# EAGLE schematic CALalarm-r0 (EAGLE 7.7.0)
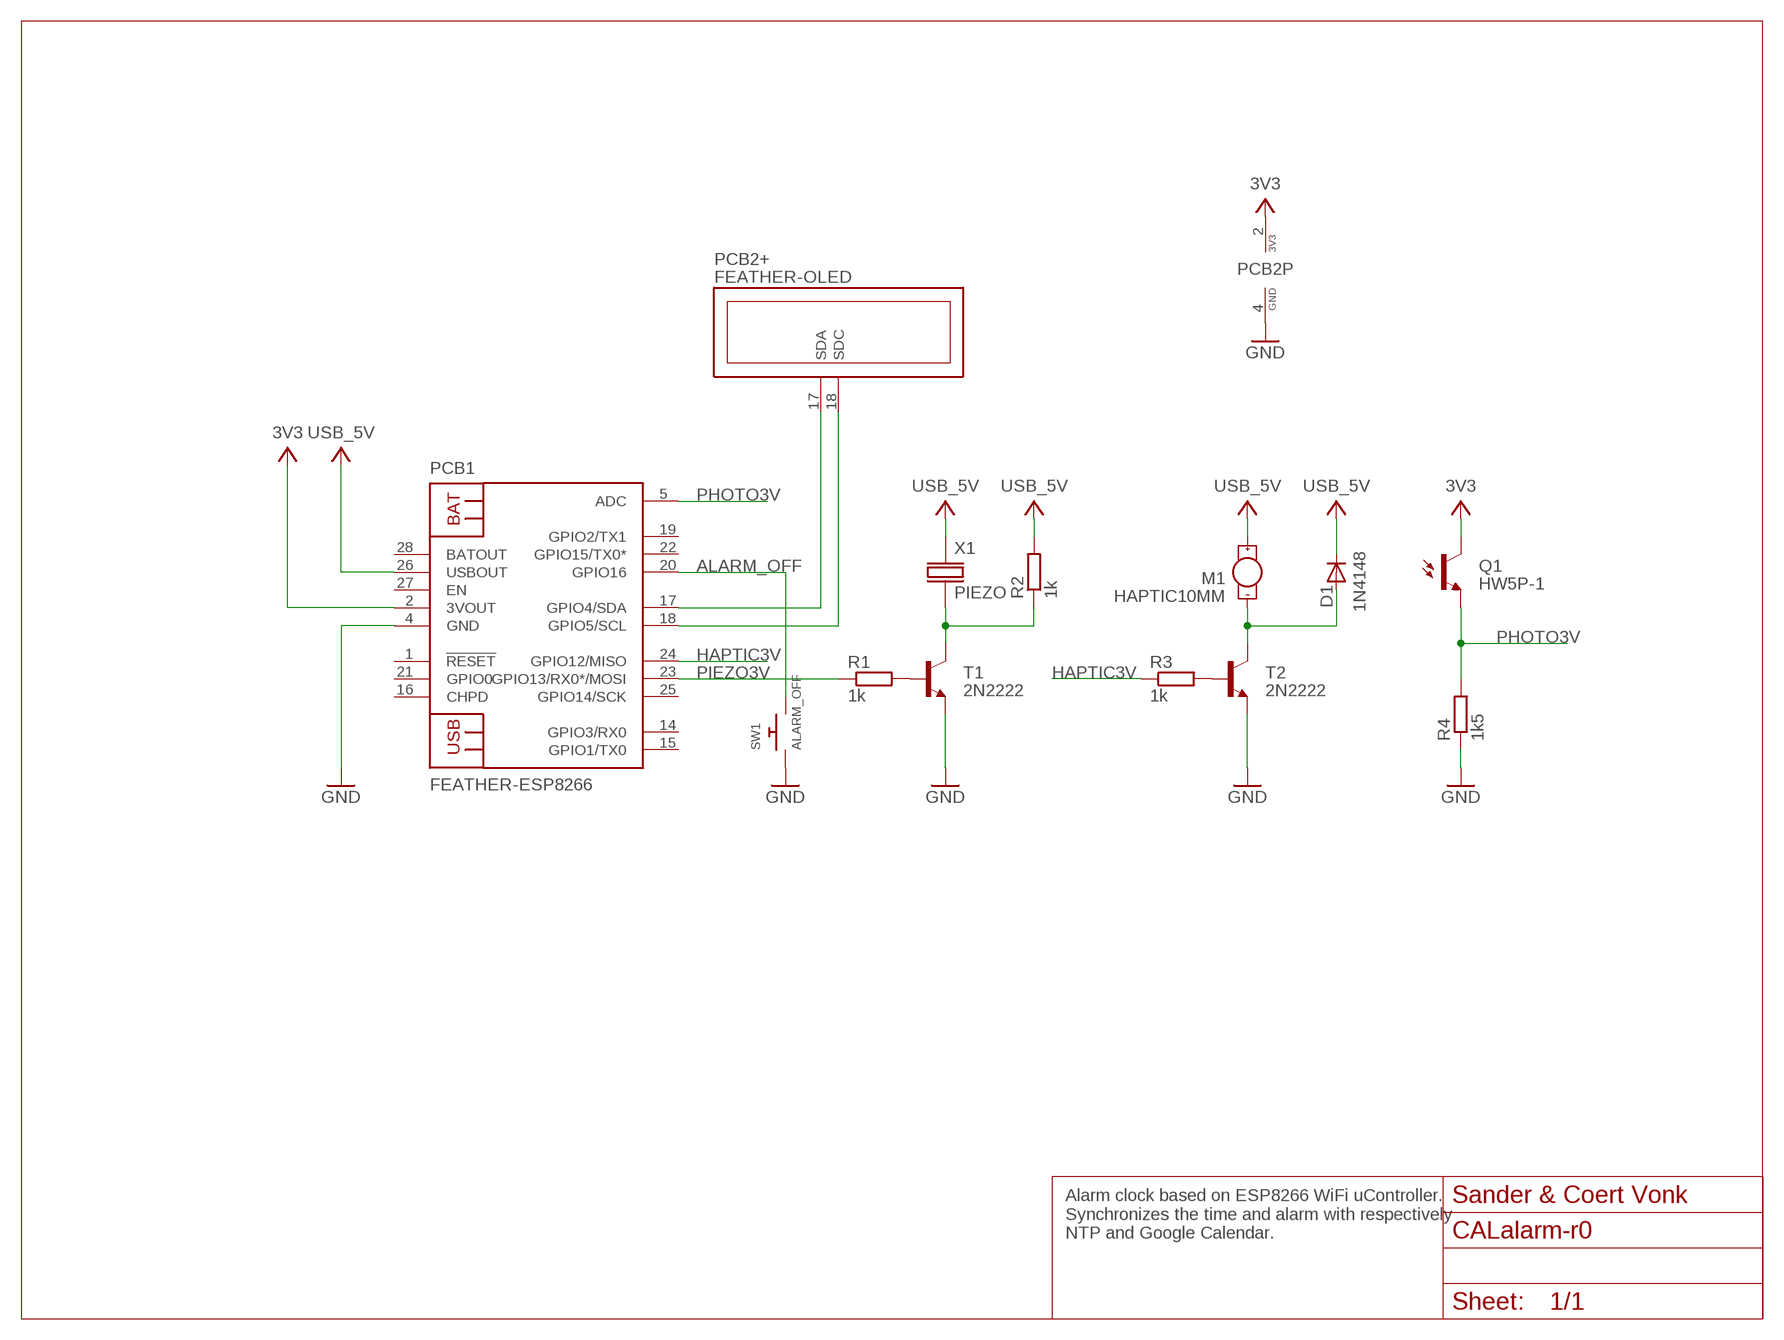
[diagram p0: schematic, sheet 1]
U$1 (FRAME_LETTER_L): AUTHOR_NAME: Sander & Coert Vonk; REV: v1.0; URL: http://www.coertvonk.com

## Parts
D1  1N4148  1N4148DO35-10  [DO35-10]
M1  HAPTIC10MM  [VIBE-MOTOR-10MM]
PCB1  FEATHER-ESP8266  [FEATHER-ESP8266]
PCB2  FEATHER-OLED  [FEATHER-OLED]
Q1  HW5P-1  PHOTOTRANSISTORPT17-21C-L41-TR8  [PT17-21C-L41-TR8]
R1  1k  R-EU_0411/15  [0411/15]
R2  1k  R-EU_0411/15  [0411/15]
R3  1k  R-EU_0411/15  [0411/15]
R4  1k5  R-EU_0411/15  [0411/15]
SW1  ALARM_OFF  SWITCH_PUSHBUTTONSOFTTOUCHSMD_SJ  [PUSHBUTTON_SMD_SJ]
T1  2N2222  [TO92-EBC-OVAL]
T2  2N2222  [TO92-EBC-OVAL]
X1  PIEZO  [0402-CAP]

## Nets
+3V3: PCB1.2(3VOUT) PCB2.2(P:VCC) Q1.C ; supply symbol labelled 3V3
+5V: D1.C M1.+ R2.2 X1.1 ; supply symbol labelled USB_5V
ALARM_OFF: PCB1.20(GPIO16) SW1.P$2
GND: PCB1.4(GND) PCB2.4(P:GND) R4.1 SW1.P$1 T1.E T2.E
HAPTIC3V: PCB1.24(GPIO12/MISO) R3.1
N$1: R2.1 T1.C X1.2
N$2: R1.2 T1.B
N$4: D1.A M1.- T2.C
N$5: R3.2 T2.B
N$6: PCB1.17(GPIO4/SDA) PCB2.17(+:SDA)
N$7: PCB1.18(GPIO5/SCL) PCB2.18(+:SDC)
PHOTO3V: PCB1.5(ADC) Q1.E R4.2
PIEZO3V: PCB1.23(GPIO13/RX0*/MOSI) R1.1
USBOUT: PCB1.26(USBOUT) ; supply symbol labelled USB_5V
Unconnected: PCB1.1(!RESET) PCB1.14(GPIO3/RX0) PCB1.15(GPIO1/TX0) PCB1.16(CHPD) PCB1.19(GPIO2/TX1) PCB1.21(GPIO0) PCB1.22(GPIO15/TX0*) PCB1.25(GPIO14/SCK) PCB1.27(EN) PCB1.28(BATOUT) PCB2.1 PCB2.19 PCB2.20 PCB2.21

## Notes on the sheet
- Alarm clock based on ESP8266 WiFi uController.
  Synchronizes the time and alarm with respectively
  NTP and Google Calendar.

## Library data of the parts
D1 = diode:1N4148: DIODE high speed (Philips)
M1 = Coert Vonk:HAPTIC: Vibration Motor- ROB-08449 Physical dimension and wire connections for this powerful vibration motor. Motor has a self adhesive backing.
PCB1 = Coert Vonk:FEATHER-ESP8266: Adafruit Feather HUZZAH ESP8266 ESP8266 WiFi development board with built in USB and battery charging. Source: https://www.adafruit.com/products/2821, https://learn.adafruit.com/adafruit-feather-huzzah-esp8266
PCB2 = Coert Vonk:FEATHER-OLED: Package buttons position and size approximate
Q1 = SparkFun-DiscreteSemi:PHOTOTRANSISTOR; PROD_ID: TRANS-12141
R1-R4 = resistor:R-EU_: RESISTOR, European symbol
SW1 = Coert Vonk:SWITCH_PUSHBUTTON: Buttons SOFTTOUCHSMD_SJ - Soft touch temporary push button (Super Junk Akihabara) Compatible with SKPMANE010 [Mouser: 688-SKPMAN] C&K_KSS = Digikey: KSS221GLFS
T1 T2 = adafruit:2N2222: NPN TRANSISTOR Big oval pads
X1 = Coert Vonk:PIEZO: Dummy package